# EAGLE design Ninja Breakout (EAGLE 5.11)
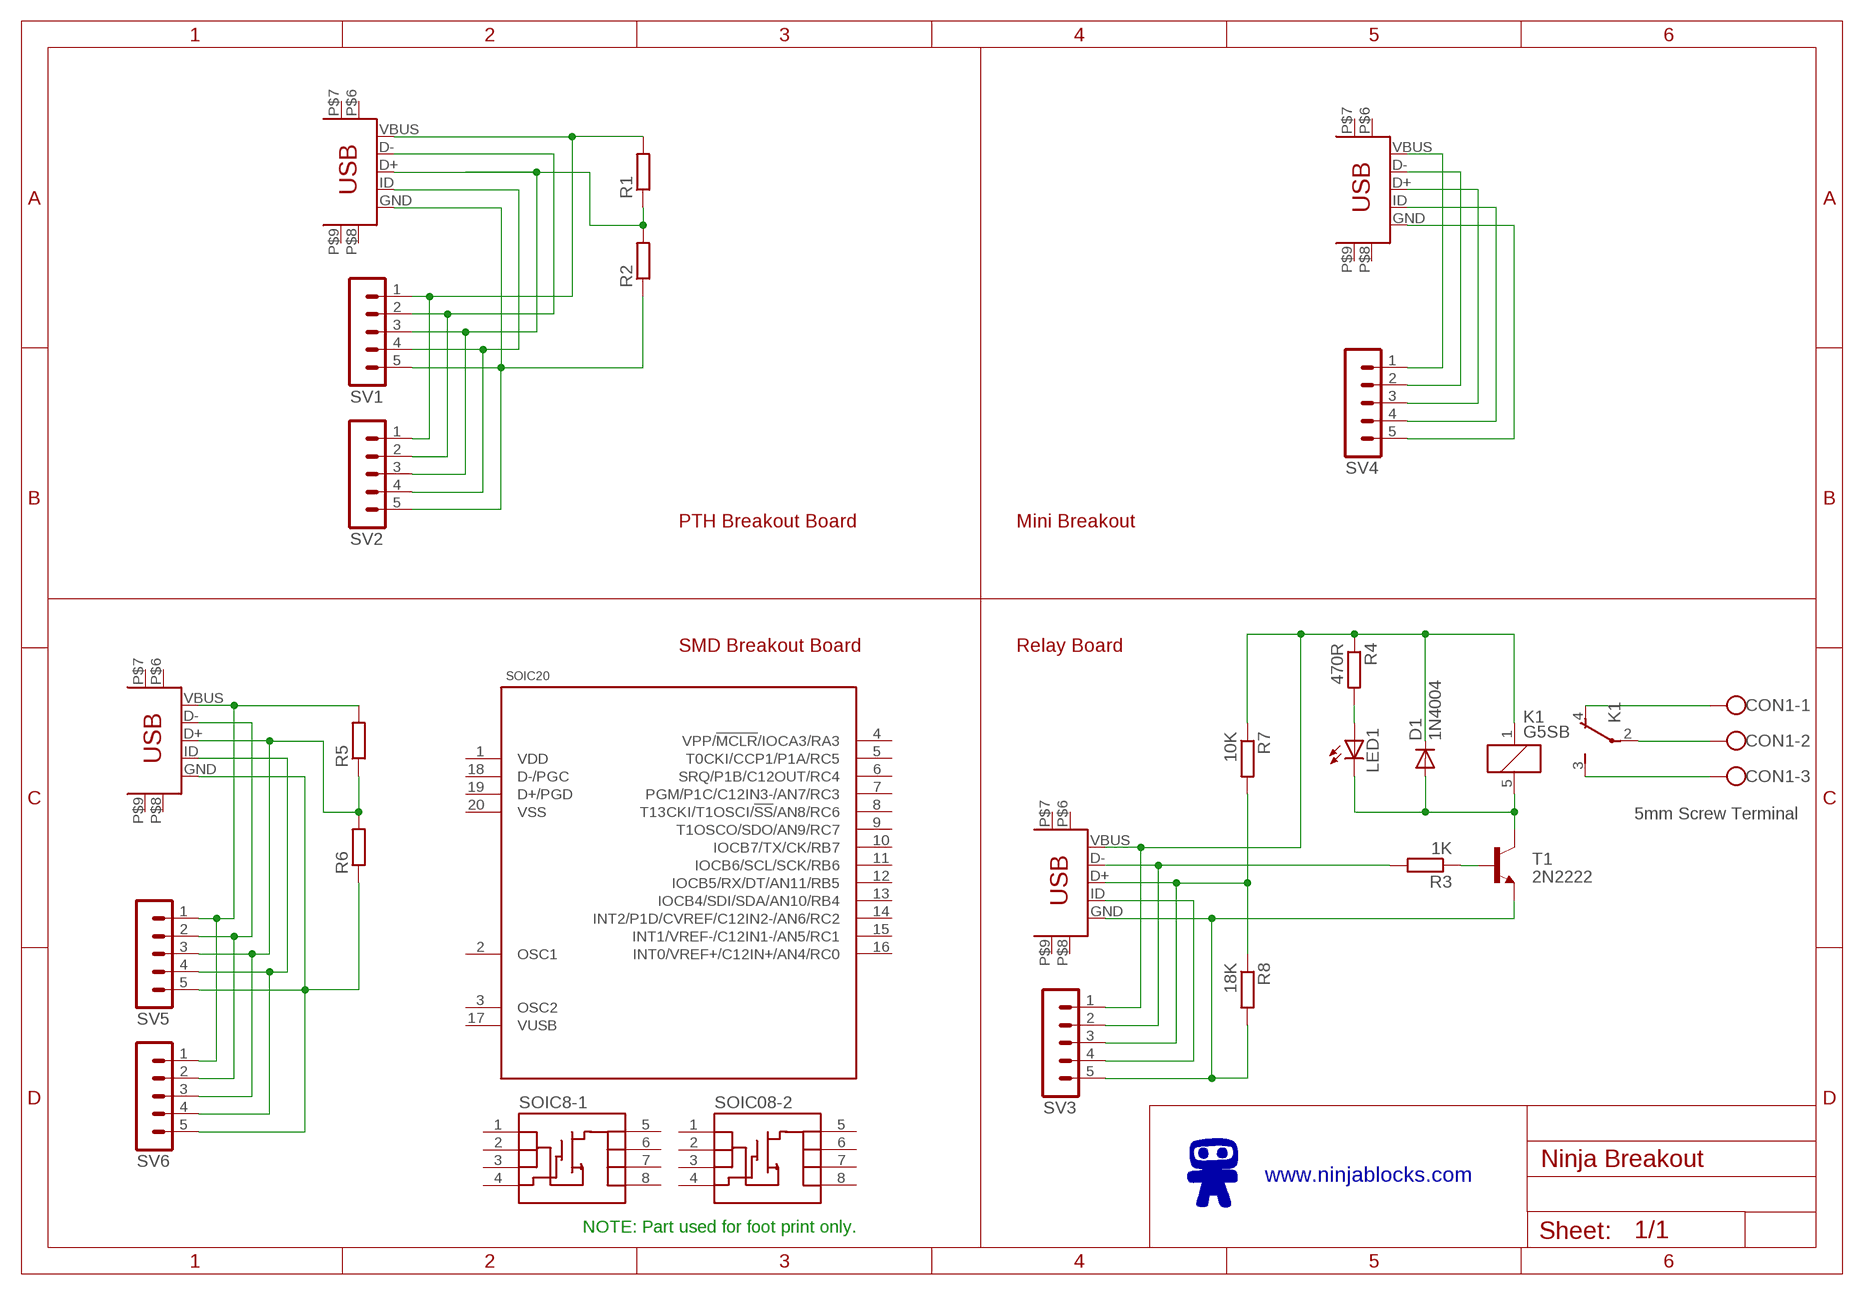
[diagram p0: schematic, sheet 1]

## Parts
CON1  5mm Screw Terminal  W237-103  [W237-103]
D1  1N4004  [DO41-10]
K1  G5SB  [G5SB]
LED1  LED3MM  [LED3MM]
R1  R-EU_0207/10  [0207/10]
R2  R-EU_0207/10  [0207/10]
R3  1K  R-EU_0207/10  [0207/10]
R4  470R  R-EU_0207/10  [0207/10]
R5  R-EU_0207/10  [0207/10]
R6  R-EU_0207/10  [0207/10]
R7  10K  R-EU_0207/10  [0207/10]
R8  18K  R-EU_0207/10  [0207/10]
SOIC8-1  MOSFET-NCHANNEL-SOIC8  [SO08]
SOIC08-2  MOSFET-NCHANNEL-SOIC8  [SO08]
SOIC20  PIC18F14K50-SOIC  [SO20W]
SV1  MA05-1  [MA05-1]
SV2  MA05-1  [MA05-1]
SV3  MA05-1  [MA05-1]
SV4  MA05-1  [MA05-1]
SV5  MA05-1  [MA05-1]
SV6  MA05-1  [MA05-1]
T1  2N2222  [TO92-EBC-OVAL]
U$1  MINI_B_PTH  [MINIB_PTH]
U$6  MINI_B_PTH  [MINIB_PTH]
U$7  MINI_B_PTH  [MINIB_PTH]
U$8  MINI_B_PTH  [MINIB_PTH]

## Nets
D+: R1.1 R2.2 SV1.3 SV2.3 U$1.D+
D-: SV1.2 SV2.2 U$1.D-
GND: R2.1 R6.1 R8.2 SV1.5 SV2.5 SV3.5 SV4.5 SV5.5 SV6.5 T1.E U$1.GND U$6.GND U$7.GND U$8.GND
ID: SV1.4 SV2.4 U$1.ID
N$254: D1.A K1.5 LED1.K(C) T1.C
N$271: CON1.1 K1.4(U:O)
N$278: D1.C K1.1 R4.1 R7.1 SV3.1 U$6.VBUS
N$279: R3.1 T1.B
N$280: R3.2 SV3.2 U$6.D-
N$281: LED1.A R4.2
N$282: CON1.2 K1.2(U:P)
N$283: CON1.3 K1.3(U:S)
N$284: R7.2 R8.1 SV3.3 U$6.D+
N$285: SV3.4 U$6.ID
N$287: SV4.1 U$7.VBUS
N$288: SV4.2 U$7.D-
N$289: SV4.3 U$7.D+
N$290: SV4.4 U$7.ID
N$292: R5.2 SV5.1 SV6.1 U$8.VBUS
N$293: SV5.2 SV6.2 U$8.D-
N$294: R5.1 R6.2 SV5.3 SV6.3 U$8.D+
N$295: SV5.4 SV6.4 U$8.ID
VBUS: R1.2 SV1.1 SV2.1 U$1.VBUS
Unconnected: SOIC8-1.1(S) SOIC8-1.2(S) SOIC8-1.3(S) SOIC8-1.4(G) SOIC8-1.5(D) SOIC8-1.6(D) SOIC8-1.7(D) SOIC8-1.8(D) SOIC08-2.1(S) SOIC08-2.2(S) SOIC08-2.3(S) SOIC08-2.4(G) SOIC08-2.5(D) SOIC08-2.6(D) SOIC08-2.7(D) SOIC08-2.8(D) SOIC20.2(OSC1) SOIC20.3(OSC2) SOIC20.4(VPP/!MCLR!/IOCA3/RA3) SOIC20.5(T0CKI/CCP1/P1A/RC5) SOIC20.6(SRQ/P1B/C12OUT/RC4) SOIC20.7(PGM/P1C/C12IN3-/AN7/RC3) SOIC20.8(T13CKI/T1OSCI/!SS!/AN8/RC6) SOIC20.9(T1OSCO/SDO/AN9/RC7) SOIC20.10(IOCB7/TX/CK/RB7) SOIC20.11(IOCB6/SCL/SCK/RB6) SOIC20.12(IOCB5/RX/DT/AN11/RB5) SOIC20.13(IOCB4/SDI/SDA/AN10/RB4) SOIC20.14(INT2/P1D/CVREF/C12IN2-/AN6/RC2) SOIC20.15(INT1/VREF-/C12IN1-/AN5/RC1) SOIC20.16(INT0/VREF+/C12IN+/AN4/RC0) SOIC20.18(D-/PGC) SOIC20.19(D+/PGD) U$1.P$6(MTN1) U$1.P$7(MTN2) U$1.P$8(MTN3) U$1.P$9(MTN4) U$6.P$6(MTN1) U$6.P$7(MTN2) U$6.P$8(MTN3) U$6.P$9(MTN4) U$7.P$6(MTN1) U$7.P$7(MTN2) U$7.P$8(MTN3) U$7.P$9(MTN4) U$8.P$6(MTN1) U$8.P$7(MTN2) U$8.P$8(MTN3) U$8.P$9(MTN4)

## Notes on the sheet
- PTH Breakout Board | Mini Breakout
- SMD Breakout Board | Relay Board
- www.ninjablocks.com
- NOTE: Part used for foot print only.

## Power pins joined to a net without a drawn wire
VDD: SOIC20.1(VDD)
VSS: SOIC20.20(VSS)
VUSB: SOIC20.17(VUSB)

## Library data of the parts
CON1 = con-wago-500:W237-103: WAGO SCREW CLAMP; MPN: 237-103; OC_FARNELL: unknown; OC_NEWARK: 18M7116
D1 = adafruit:1N4004: DIODE General purpose 1N400x type rectifier (With bigger pads) http://www.ladyada.net/library/pcb/eaglelibrary.html
K1 = relay:G5SB: Compact Single-pole Relay for Switching 5 A Source: http://www.omron.com/ecb/products/pry/121/g5sb.html; OC_FARNELL: unknown; OC_NEWARK: unknown
LED1 = adafruit:LED: LED OSRAM: - CHIPLED LG R971, LG N971, LY N971, LG Q971, LY Q971, LO R971, LY R971 LH N974, LH R974 LS Q976, LO Q976, LY Q976 LO Q996 - Hyper CHIPLED LW Q18S LB Q993, LB Q99A, LB R99A - SideLED LS A670, LO A670, LY A670, LG A670, LP A670 LB A673, LV A673, LT A673, LW A673 LH A674 LY A675 LS A676, LA A676, LO A676, LY A676, LW A676 LS A679, LY A679, LG A679 - Hyper Micro SIDELED® LS Y876, LA Y876, LO Y876, LY Y876 LT Y87S - SmartLED LW L88C, LW L88S LB L89C, LB L89S, LG L890 LS L89K, LO L89K, LY L89K LS L896, LA L896, LO L896, LY L896 - TOPLED LS T670, LO T670, LY T670, LG T670, LP T670 LSG T670, LSP T670, LSY T670, LOP T670, LYG T670 LG T671, LOG T671, LSG T671 LB T673, LV T673, LT T673, LW T673 LH T674 LS T676, LA T676, LO T676, LY T676, LB T676, LH T676, LSB T676, LW T676 LB T67C, LV T67C, LT T67C, LS T67K, LO T67K, LY T67K, LW E67C LS E67B, LA E67B, LO E67B, LY E67B, LB E67C, LV E67C, LT E67C LW T67C LS T679, LY T679, LG T679 LS T770, LO T770, LY T770, LG T770, LP T770 LB T773, LV T773, LT T773, LW T773 LH T774 LS E675, LA E675, LY E675, LS T675 LS T776, LA T776, LO T776, LY T776, LB T776 LHGB T686 LT T68C, LB T68C - Hyper Mini TOPLED® LB M676 - Mini TOPLED Santana® LG M470 LS M47K, LO M47K, LY M47K Source: http://www.osram.convergy.de/
R1-R8 = resistor:R-EU_: RESISTOR, European symbol
SOIC8-1 SOIC08-2 = SparkFun:MOSFET-NCHANNEL-SOIC8: N-Channel MOSFET IRF9410 and NDS8434 are common, SOIC-8 parts.
SOIC20 = Monkey:PIC18F14K50: PIC18F/LF1XK50 20-Pin USB Flash Microcontrollers with nanoWatt XLP Technology. PIC18F13K50, PIC18LF13K50, PIC18F14K50, PIC18LF14K50. From: http://ww1.microchip.com/downloads/en/DeviceDoc/41350E.pdf
SV1-SV6 = con-lstb:MA05-1: PIN HEADER; OC_FARNELL: unknown; OC_NEWARK: unknown
T1 = adafruit:2N2222: NPN TRANSISTOR Big oval pads
U$1 U$6-U$8 = Ninja:MINI_B_PTH: WUERTH ELEKTRONIK - 651005136521 - MINI USB TYPE B, RECEPTACLE http://au.element14.com/wuerth-elektronik/651005136521/mini-usb-type-b-receptacle-r-a/dp/1841176

## Board
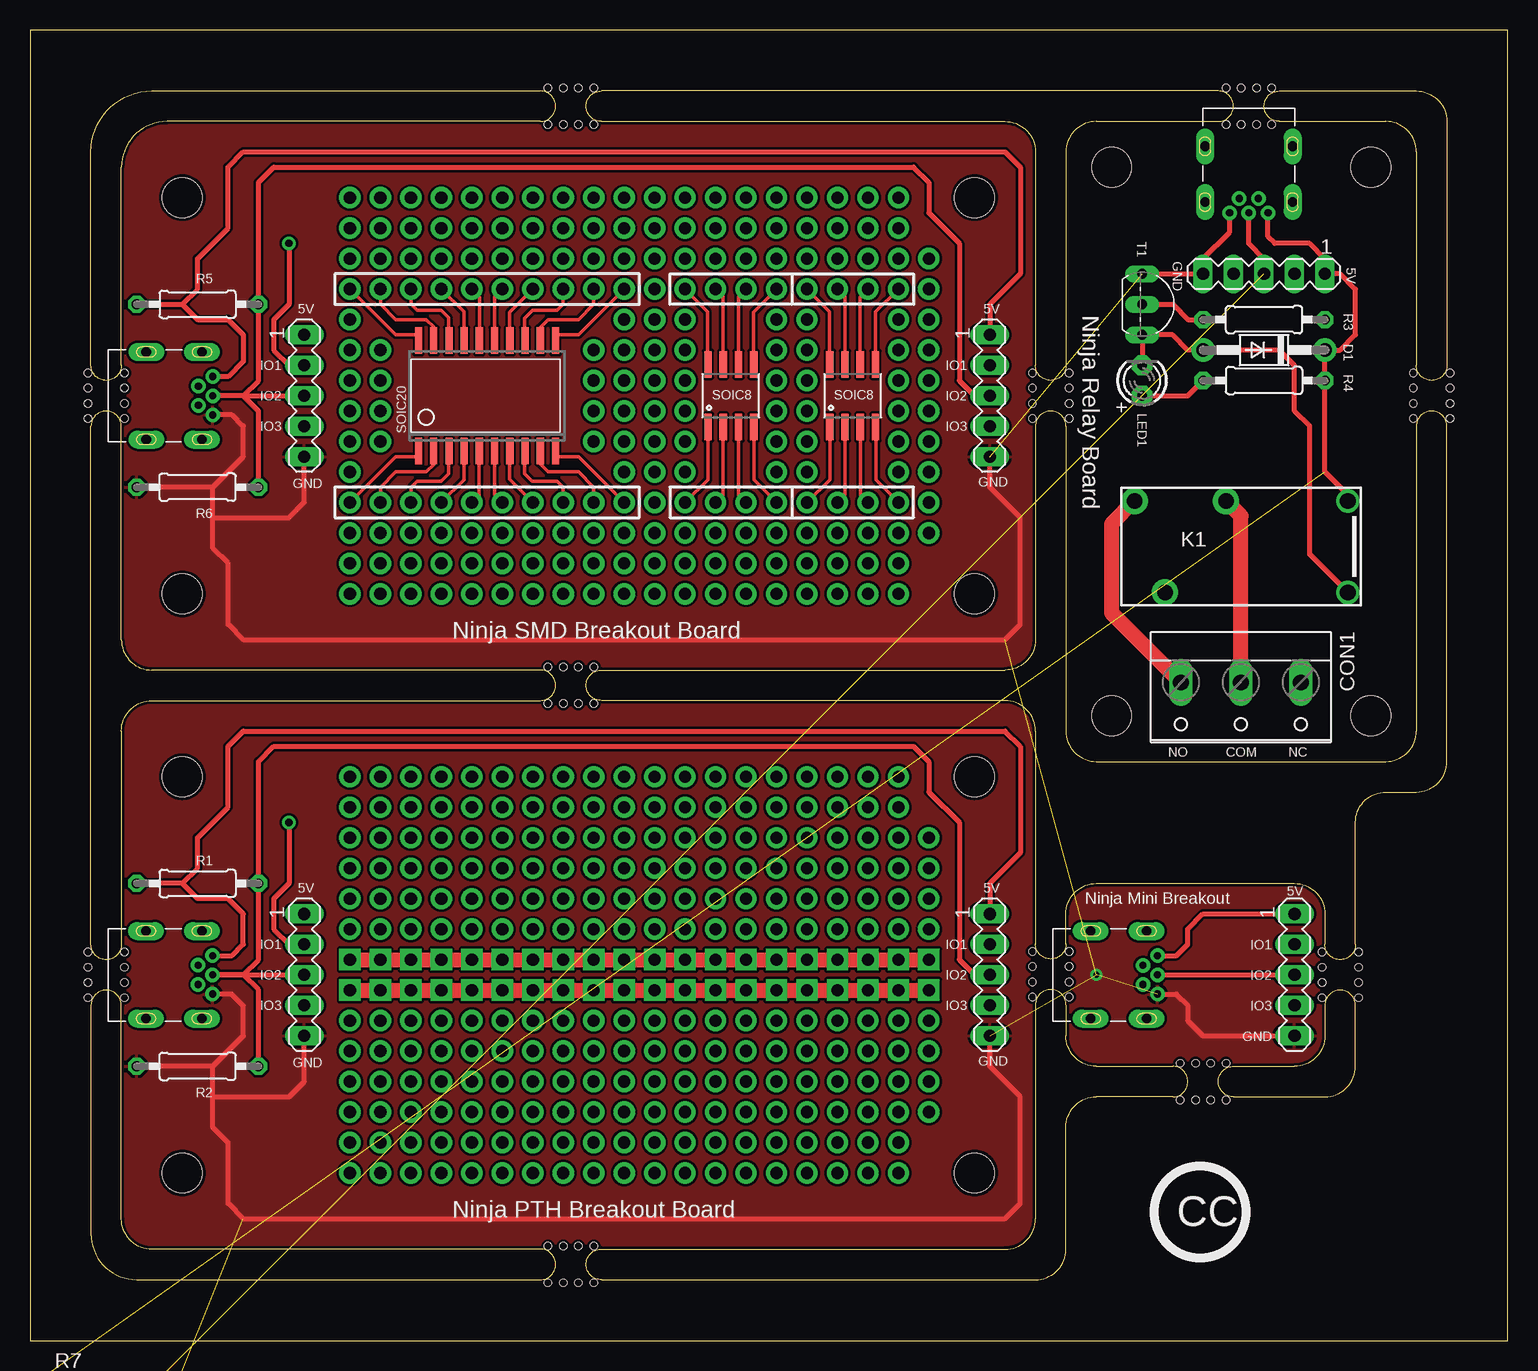
[diagram p1: board, top side]
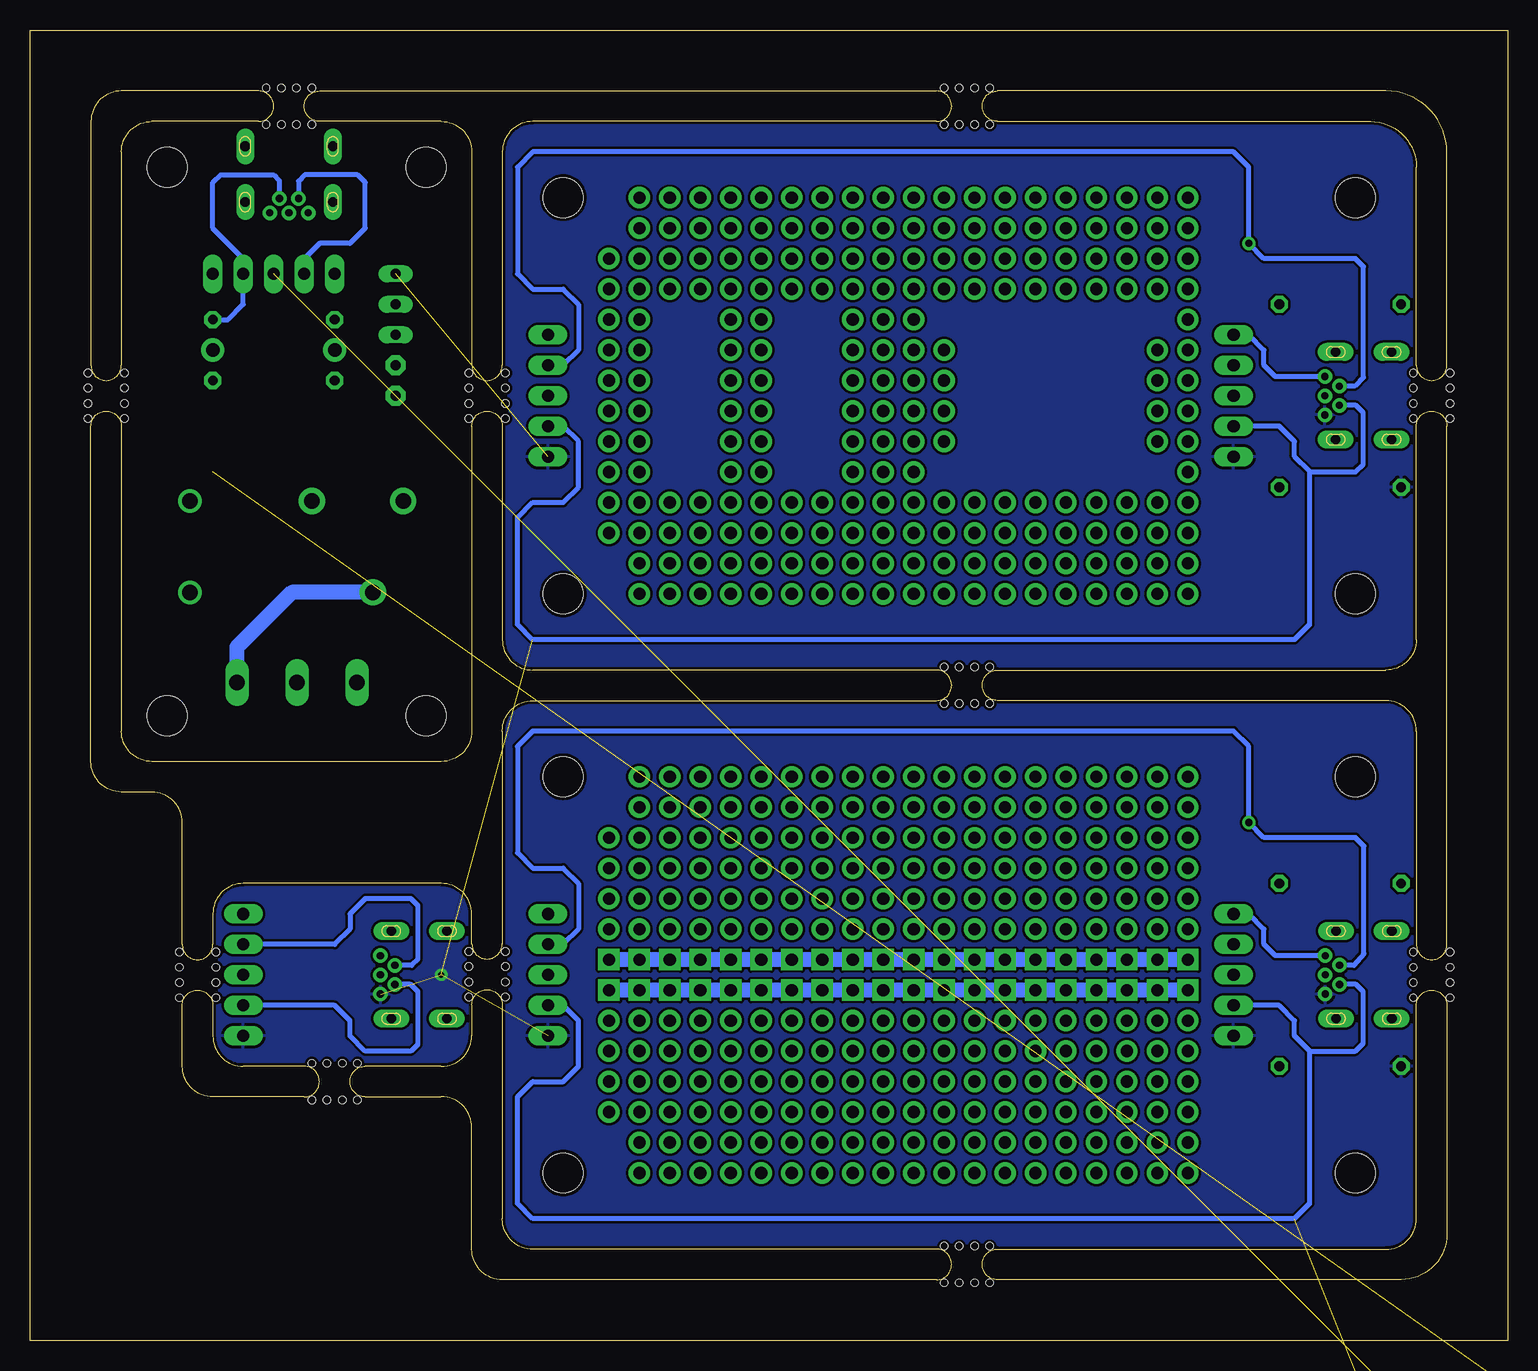
[diagram p2: board, bottom side, seen from below]

Size 123.19 x 109.22 mm. Coordinates in mm from the lower left corner, seen from the top.
Outline: 86.36,27.99 arc90 85.09,29.26 arc90 83.82,27.99
Outline: 86.36,33.07 arc-90 85.09,31.8 arc-90 83.82,33.07
Outline: 83.82,33.02 83.82,50.8 arc90 81.28,53.34 47.62,53.34 arc-90 46.35,54.61 arc-90 47.62,55.88 81.28,55.88 arc90 83.82,58.42 83.82,76.2 arc-90 85.09,77.47 arc-90 86.36,76.2 86.36,50.8 arc90 88.9,48.26 113.03,48.26 arc90 115.57,50.8 115.57,76.2 arc-90 116.84,77.47 arc-90 118.11,76.2 118.11,48.26 arc-90 115.57,45.72 113.03,45.72 arc90 110.49,43.18 110.49,33.02 arc-90 109.22,31.75 arc-90 107.95,33.02 107.95,35.56 arc90 105.41,38.1 88.9,38.1 arc90 86.36,35.56 86.36,33.02
Outline: 83.82,27.94 83.82,10.16 arc-90 81.28,7.62 47.62,7.62 arc90 46.35,6.35 arc90 47.62,5.08 83.82,5.08 arc90 86.36,7.62 86.36,17.78 arc-90 88.9,20.32 95.25,20.32 arc90 96.52,21.59 arc90 95.25,22.86 88.9,22.86 arc-90 86.36,25.4 86.36,27.94
Outline: 88.9,101.6 arc90 86.36,99.06 86.36,81.28 arc-90 85.09,80.01 arc-90 83.82,81.28 83.82,99.06 arc90 81.28,101.6 47.62,101.6 arc-90 46.35,102.87 arc-90 47.62,104.14 99.06,104.14 arc-90 100.33,102.87 arc-90 99.06,101.6 88.9,101.6
Outline: 115.57,99.06 arc90 113.03,101.6 104.14,101.6 arc-90 102.87,102.87 arc-90 104.14,104.14 115.57,104.14 arc-90 118.11,101.6 118.11,81.28 arc-90 116.84,80.01 arc-90 115.57,81.28 115.57,99.06
Outline: 107.95,25.4 arc-90 105.41,22.86 100.33,22.86 arc90 99.06,21.59 arc90 100.33,20.32 107.95,20.32 arc90 110.49,22.86 110.49,27.94 arc90 109.22,29.21 arc90 107.95,27.94 107.95,25.4
Outline: 42.54,53.34 arc90 43.81,54.61 arc90 42.54,55.88 10.16,55.88 arc-90 7.62,58.42 7.62,76.2 arc90 6.35,77.47 arc90 5.08,76.2 5.08,33.02 arc90 6.35,31.75 arc90 7.62,33.02 7.62,50.8 arc-90 10.16,53.34 42.54,53.34
Outline: 7.62,81.28 arc-90 6.35,80.01 arc-90 5.08,81.28 5.08,99.06 arc-90 10.16,104.14 42.54,104.14 arc-90 43.81,102.87 arc-90 42.54,101.6 11.43,101.6 arc90 7.62,97.79 7.62,81.28
Outline: 7.62,27.94 arc90 6.35,29.21 arc90 5.08,27.94 5.08,8.89 arc90 8.89,5.08 42.54,5.08 arc90 43.81,6.35 arc90 42.54,7.62 10.16,7.62 arc-90 7.62,10.16 7.62,27.94
Outline: 123.19,0 123.19,109.22 0,109.22 0,0 123.19,0
Copper layers (1*16): Top 0.035mm / dielectric 1.5mm / Bottom 0.035mm
Design rules "SparkFun": minimum track width 8mil, minimum drill 20mil, track to track 8mil, track to pad 8mil, pad to pad 8mil, via to via 8mil, smd to smd 8mil, copper to edge 10mil, drill to drill 8mil, minimum pad ring 12mil, minimum via ring 10mil, stop-mask expansion 4mil, vias tented up to drill 25mil, thermal gap 10mil
Holes 0.6 mm at 45.72,53.09 44.45,53.09 43.18,53.09 46.99,53.09 45.72,56.13 44.45,56.13 43.18,56.13 46.99,56.13 86.61,31.17 86.61,29.9 86.61,28.63 86.61,32.44 83.57,31.17 83.57,29.9 83.57,28.63 83.57,32.44 7.87,79.38 7.87,78.1 7.87,76.83 7.87,80.64 4.83,79.38 4.83,78.1 4.83,76.83 4.83,80.64 7.87,31.12 7.87,29.84 7.87,28.57 7.87,32.38 4.83,31.12 4.83,29.84 4.83,28.57 4.83,32.38 45.72,4.83 44.45,4.83 43.18,4.83 46.99,4.83 45.72,7.87 44.45,7.87 43.18,7.87 46.99,7.87 45.72,101.35 44.45,101.35 43.18,101.35 46.99,101.35 45.72,104.39 44.45,104.39 43.18,104.39 46.99,104.39 86.61,79.38 86.61,78.1 86.61,76.83 86.61,80.64 83.57,79.38 83.57,78.1 83.57,76.83 83.57,80.64 118.36,79.38 118.36,78.1 118.36,76.83 118.36,80.64 115.32,79.38 115.32,78.1 115.32,76.83 115.32,80.64 110.74,31.12 110.74,29.84 110.74,28.57 110.74,32.38 107.7,31.12 107.7,29.84 107.7,28.57 107.7,32.38 102.23,101.35 100.97,101.35 99.7,101.35 103.51,101.35 102.23,104.39 100.97,104.39 99.7,104.39 103.51,104.39 98.43,20.07 97.16,20.07 95.89,20.07 99.7,20.07 98.43,23.11 97.16,23.11 95.89,23.11 99.7,23.11

### Footprints (pad centres in the part's own frame; a part is rotated, then mirrored left to right if it is on the bottom)
W237-103 = drill 1.3 long: 1 -5,-1.29; 2 0,-1.29; 3 5,-1.29
DO41-10 = drill 1.118 pad 1.93 round: A 5.08,0; C -5.08,0
G5SB = drill 1.3 pad 1.93 round: 1 7.62,3.81; 5 7.62,-3.81 | drill 1.3 pad 2.184 round: 2 -2.54,3.81; 3 -10.16,3.81; 4 -7.62,-3.81
LED3MM = drill 0.813 pad 1.676 octagon: A -1.27,0; K 1.27,0
0207/10 = drill 0.813 octagon: 1 -5.08,0; 2 5.08,0
SO08 = smd 0.61 x 2.21: 1 -1.905,-2.616; 2 -0.635,-2.616; 3 0.635,-2.616; 4 1.905,-2.616; 5 1.905,2.616; 6 0.635,2.616; 7 -0.635,2.616; 8 -1.905,2.616
SO20W = smd 0.6 x 2.2: 1 -5.715,-4.6; 2 -4.445,-4.6; 3 -3.175,-4.6; 4 -1.905,-4.6; 5 -0.635,-4.6; 6 0.635,-4.6; 7 1.905,-4.6; 8 3.175,-4.6; 9 4.445,-4.6; 10 5.715,-4.6; 11 5.715,4.6; 12 4.445,4.6; 13 3.175,4.6; 14 1.905,4.6; 15 0.635,4.6; 16 -0.635,4.6; 17 -1.905,4.6; 18 -3.175,4.6; 19 -4.445,4.6; 20 -5.715,4.6
MA05-1 = drill 1.016 long: 1 -5.08,0; 2 -2.54,0; 3 0,0; 4 2.54,0; 5 5.08,0
TO92-EBC-OVAL = drill 0.813 long: B 0,-1.27; C 2.54,-1.27; E -2.54,-1.27
MINIB_PTH = drill 0.6 round: D+ 0,0; D- 0.8,1.2; GND -1.6,0; ID -0.8,1.2; VBUS 1.6,0 | drill 0.8 pad 1.5 long: P$6 3.65,0.9; P$7 3.65,5.55; P$8 -3.65,0.9; P$9 -3.65,5.55
STAND-OFF = hole 3.302: 0,0

### Placement (x,y rotation side)
CON1  100.94,53.57 180 top
D1  102.87,82.55 180 top
K1  102.23,66.17 0 top
LED1  92.71,80.01 90 top
R1  13.97,38.1 180 top
R2  13.97,22.86 0 top
R3  102.87,85.09 0 top
R4  102.87,80.01 180 top
R5  13.97,86.36 180 top
R6  13.97,71.12 0 top
R7  5.08,-3.81 0 top  (outside the outline)
R8  5.08,-8.89 0 top  (outside the outline)
SOIC8-1  58.42,78.74 0 top
SOIC08-2  68.58,78.74 0 top
SOIC20  38.1,78.74 0 top
SV1  80.01,30.48 270 top
SV2  22.86,30.48 270 top
SV3  102.87,88.9 180 top
SV4  105.41,30.48 270 top
SV5  22.86,78.74 270 top
SV6  80.01,78.74 270 top
T1  93.98,86.36 270 top
U$1  15.22,30.49 90 top
U$2  [STAND-OFF]  12.7,46.99 0 top
U$3  [STAND-OFF]  12.7,13.97 0 top
U$4  [STAND-OFF]  78.74,13.97 0 top
U$5  [STAND-OFF]  78.74,46.99 0 top
U$6  101.6,93.98 0 top
U$7  93.98,30.48 90 top
U$8  15.24,78.74 90 top
U$9  [STAND-OFF]  12.7,95.25 0 top
U$10  [STAND-OFF]  12.7,62.23 0 top
U$11  [STAND-OFF]  78.74,95.25 0 top
U$12  [STAND-OFF]  78.74,62.23 0 top
U$13  [STAND-OFF]  111.76,52.07 270 top
U$14  [STAND-OFF]  90.17,52.07 270 top
U$15  [STAND-OFF]  90.17,97.79 270 top
U$16  [STAND-OFF]  111.76,97.79 270 top

### Tracks (layer width: path | path; a pad name or v marks a point on that pad's centre or on a via)
D+
  Top 0.406: SV1.3 78.74,30.48 77.47,31.75 77.47,43.18 74.93,45.72 74.93,48.26 73.66,49.53 20.32,49.53 19.05,48.26 R1.1 19.05,31.75 17.79,30.48 | 17.79,30.48 U$1.D+ SV2.3 | R2.2 19.05,29.22 17.79,30.48
D-  (via drill 0.6)
  Top 0.406: SV2.2 21.59,33.02 20.32,34.29 20.32,36.83 21.59,38.1 v21.59,43.18
  Bottom 0.406: U$1.D- 12.82,31.28 11.99,32.26 11.99,41.2 12.7,41.91 20.32,41.91 v21.59,43.18 21.59,49.53 22.86,50.8 81.28,50.8 82.55,49.53 82.55,40.64 81.28,39.37 78.74,39.37 77.47,38.1 77.47,34.29 78.74,33.02 SV1.2
GND  (via drill 0.5)  (5 unrouted)
  Top 0.406: 15.24,22.86 R2.1 | 15.24,22.86 17.78,25.4 17.78,27.91 16.82,28.88 U$1.GND | SV2.5 22.86,21.59 21.59,20.32 15.24,20.32 | 15.24,20.32 15.24,17.78 16.51,16.51 16.51,11.43 17.78,10.16 81.28,10.16 82.55,11.43 82.55,20.32 80.01,22.86 SV1.5 | 15.24,20.32 15.24,22.86 | T1.E SV3.5 97.79,90.17 100,92.38 U$6.GND | U$7.GND 95.58,28.88 96.52,27.94 96.52,26.67 97.79,25.4 SV4.5 | U$8.GND 16.84,77.14 17.78,76.2 17.78,73.66 15.24,71.12 | 15.24,71.12 R6.1 | SV5.5 22.86,69.85 21.59,68.58 15.24,68.58 | 15.24,68.58 15.24,71.12 | 15.24,68.58 15.24,66.04 16.51,64.77 16.51,59.69 17.78,58.42 81.28,58.42 82.55,59.69 82.55,68.58 80.01,71.12 SV6.5
  other vias: 88.9,30.48
  pour Top: -1.27,110.49 85.09,110.49 85.09,109.22 85.09,46.99 124.46,46.99 124.46,-1.27 -1.27,-1.27 -1.27,0
  pour Bottom: -1.27,110.49 85.09,110.49 85.09,73.66 85.09,46.99 124.46,46.99 124.46,-1.27 -1.27,-1.27
ID
  Bottom 0.406: U$1.ID 12.67,29.69 12.07,29.08 12.07,24.77 12.7,24.13 16.51,24.13 | 16.51,24.13 17.78,25.4 17.78,26.67 19.05,27.94 SV2.4 | 16.51,24.13 16.51,11.43 17.78,10.16 81.28,10.16 82.55,11.43 82.55,20.32 81.28,21.59 78.74,21.59 77.47,22.86 77.47,26.67 78.74,27.94 SV1.4
N$1  (via drill 1.02 pad 1.78)
  other vias: 26.67,46.99
N$2  (via drill 1.02 pad 1.78)
  other vias: 29.21,46.99
N$3  (via drill 1.02 pad 1.78)
  other vias: 31.75,46.99
N$4  (via drill 1.02 pad 1.78)
  other vias: 26.67,26.67
N$5  (via drill 1.02 pad 1.78)
  Top 1.27: v26.67,31.75 v74.93,31.75
  Bottom 1.27: v26.67,31.75 v74.93,31.75
N$6  (via drill 1.02 pad 1.78)
  other vias: 29.21,26.67
N$7  (via drill 1.02 pad 1.78)
  other vias: 31.75,26.67
N$8  (via drill 1.02 pad 1.78)
  other vias: 34.29,26.67
N$9  (via drill 1.02 pad 1.78)
  other vias: 36.83,26.67
N$10  (via drill 1.02 pad 1.78)
  other vias: 34.29,46.99
N$11  (via drill 1.02 pad 1.78)
  other vias: 39.37,26.67
N$12  (via drill 1.02 pad 1.78)
  other vias: 36.83,46.99
N$13  (via drill 1.02 pad 1.78)
  other vias: 39.37,46.99
N$14  (via drill 1.02 pad 1.78)
  other vias: 41.91,46.99
N$15  (via drill 1.02 pad 1.78)
  other vias: 54.61,46.99
N$16  (via drill 1.02 pad 1.78)
  other vias: 57.15,46.99
N$17  (via drill 1.02 pad 1.78)
  other vias: 69.85,46.99
N$18  (via drill 1.02 pad 1.78)
  other vias: 29.21,31.75
N$19  (via drill 1.02 pad 1.78)
  other vias: 29.21,29.21
N$20  (via drill 1.02 pad 1.78)
  other vias: 41.91,26.67
N$21  (via drill 1.02 pad 1.78)
  other vias: 54.61,26.67
N$22  (via drill 1.02 pad 1.78)
  other vias: 26.67,24.13
N$23  (via drill 1.02 pad 1.78)
  other vias: 29.21,24.13
N$24  (via drill 1.02 pad 1.78)
  other vias: 31.75,24.13
N$25  (via drill 1.02 pad 1.78)
  other vias: 26.67,44.45
N$26  (via drill 1.02 pad 1.78)
  other vias: 29.21,44.45
N$27  (via drill 1.02 pad 1.78)
  other vias: 31.75,44.45
N$28  (via drill 1.02 pad 1.78)
  other vias: 31.75,31.75
N$29  (via drill 1.02 pad 1.78)
  other vias: 31.75,29.21
N$30  (via drill 1.02 pad 1.78)
  other vias: 34.29,24.13
N$31  (via drill 1.02 pad 1.78)
  other vias: 36.83,24.13
N$32  (via drill 1.02 pad 1.78)
  other vias: 39.37,24.13
N$33  (via drill 1.02 pad 1.78)
  other vias: 41.91,24.13
N$34  (via drill 1.02 pad 1.78)
  other vias: 34.29,44.45
N$35  (via drill 1.02 pad 1.78)
  other vias: 44.45,24.13
N$36  (via drill 1.02 pad 1.78)
  other vias: 36.83,44.45
N$37  (via drill 1.02 pad 1.78)
  other vias: 39.37,44.45
N$38  (via drill 1.02 pad 1.78)
  other vias: 41.91,44.45
N$39  (via drill 1.02 pad 1.78)
  other vias: 44.45,44.45
N$40  (via drill 1.02 pad 1.78)
  other vias: 54.61,44.45
N$41  (via drill 1.02 pad 1.78)
  other vias: 59.69,44.45
N$42  (via drill 1.02 pad 1.78)
  other vias: 34.29,31.75
N$43  (via drill 1.02 pad 1.78)
  other vias: 34.29,29.21
N$44  (via drill 1.02 pad 1.78)
  other vias: 26.67,21.59
N$45  (via drill 1.02 pad 1.78)
  other vias: 29.21,21.59
N$46  (via drill 1.02 pad 1.78)
  other vias: 31.75,21.59
N$47  (via drill 1.02 pad 1.78)
  other vias: 34.29,21.59
N$48  (via drill 1.02 pad 1.78)
  other vias: 36.83,21.59
N$49  (via drill 1.02 pad 1.78)
  other vias: 26.67,41.91
N$50  (via drill 1.02 pad 1.78)
  other vias: 29.21,41.91
N$51  (via drill 1.02 pad 1.78)
  other vias: 31.75,41.91
N$52  (via drill 1.02 pad 1.78)
  other vias: 36.83,31.75
N$53  (via drill 1.02 pad 1.78)
  other vias: 36.83,29.21
N$54  (via drill 1.02 pad 1.78)
  other vias: 39.37,21.59
N$55  (via drill 1.02 pad 1.78)
  other vias: 41.91,21.59
N$56  (via drill 1.02 pad 1.78)
  other vias: 44.45,21.59
N$57  (via drill 1.02 pad 1.78)
  other vias: 26.67,19.05
N$58  (via drill 1.02 pad 1.78)
  other vias: 34.29,41.91
N$59  (via drill 1.02 pad 1.78)
  other vias: 29.21,19.05
N$60  (via drill 1.02 pad 1.78)
  other vias: 36.83,41.91
N$61  (via drill 1.02 pad 1.78)
  other vias: 39.37,41.91
N$62  (via drill 1.02 pad 1.78)
  other vias: 41.91,41.91
N$63  (via drill 1.02 pad 1.78)
  other vias: 44.45,41.91
N$64  (via drill 1.02 pad 1.78)
  other vias: 49.53,41.91
N$65  (via drill 1.02 pad 1.78)
  other vias: 69.85,41.91
N$66  (via drill 1.02 pad 1.78)
  other vias: 39.37,31.75
N$67  (via drill 1.02 pad 1.78)
  other vias: 39.37,29.21
N$68  (via drill 1.02 pad 1.78)
  other vias: 31.75,19.05
N$69  (via drill 1.02 pad 1.78)
  other vias: 34.29,19.05
N$70  (via drill 1.02 pad 1.78)
  other vias: 36.83,19.05
N$71  (via drill 1.02 pad 1.78)
  other vias: 39.37,19.05
N$72  (via drill 1.02 pad 1.78)
  other vias: 41.91,19.05
N$73  (via drill 1.02 pad 1.78)
  other vias: 26.67,39.37
N$74  (via drill 1.02 pad 1.78)
  other vias: 29.21,39.37
N$75  (via drill 1.02 pad 1.78)
  other vias: 31.75,39.37
N$76  (via drill 1.02 pad 1.78)
  other vias: 41.91,31.75
N$77  (via drill 1.02 pad 1.78)
  other vias: 41.91,29.21
N$78  (via drill 1.02 pad 1.78)
  other vias: 44.45,19.05
N$79  (via drill 1.02 pad 1.78)
  other vias: 26.67,16.51
N$80  (via drill 1.02 pad 1.78)
  other vias: 29.21,16.51
N$81  (via drill 1.02 pad 1.78)
  other vias: 31.75,16.51
N$82  (via drill 1.02 pad 1.78)
  other vias: 34.29,39.37
N$83  (via drill 1.02 pad 1.78)
  other vias: 34.29,16.51
N$84  (via drill 1.02 pad 1.78)
  other vias: 36.83,39.37
N$85  (via drill 1.02 pad 1.78)
  other vias: 39.37,39.37
N$86  (via drill 1.02 pad 1.78)
  other vias: 41.91,39.37
N$87  (via drill 1.02 pad 1.78)
  other vias: 44.45,39.37
N$88  (via drill 1.02 pad 1.78)
  other vias: 49.53,39.37
N$89  (via drill 1.02 pad 1.78)
  other vias: 59.69,39.37
N$90  (via drill 1.02 pad 1.78)
  other vias: 44.45,31.75
N$91  (via drill 1.02 pad 1.78)
  other vias: 44.45,29.21
N$92  (via drill 1.02 pad 1.78)
  other vias: 36.83,16.51
N$93  (via drill 1.02 pad 1.78)
  other vias: 39.37,16.51
N$94  (via drill 1.02 pad 1.78)
  other vias: 41.91,16.51
N$95  (via drill 1.02 pad 1.78)
  other vias: 44.45,16.51
N$96  (via drill 1.02 pad 1.78)
  other vias: 26.67,13.97
N$97  (via drill 1.02 pad 1.78)
  other vias: 26.67,36.83
N$98  (via drill 1.02 pad 1.78)
  other vias: 29.21,36.83
N$99  (via drill 1.02 pad 1.78)
  other vias: 31.75,36.83
N$100  (via drill 1.02 pad 1.78)
  other vias: 46.99,31.75
N$101  (via drill 1.02 pad 1.78)
  other vias: 46.99,29.21
N$102  (via drill 1.02 pad 1.78)
  other vias: 29.21,13.97
N$103  (via drill 1.02 pad 1.78)
  other vias: 31.75,13.97
N$104  (via drill 1.02 pad 1.78)
  other vias: 34.29,13.97
N$105  (via drill 1.02 pad 1.78)
  other vias: 36.83,13.97
N$106  (via drill 1.02 pad 1.78)
  other vias: 34.29,36.83
N$107  (via drill 1.02 pad 1.78)
  other vias: 39.37,13.97
N$108  (via drill 1.02 pad 1.78)
  other vias: 36.83,36.83
N$109  (via drill 1.02 pad 1.78)
  other vias: 39.37,36.83
N$110  (via drill 1.02 pad 1.78)
  other vias: 41.91,36.83
N$111  (via drill 1.02 pad 1.78)
  other vias: 44.45,36.83
N$112  (via drill 1.02 pad 1.78)
  other vias: 52.07,36.83
N$113  (via drill 1.02 pad 1.78)
  other vias: 69.85,36.83
N$114  (via drill 1.02 pad 1.78)
  other vias: 49.53,31.75
N$115  (via drill 1.02 pad 1.78)
  other vias: 49.53,29.21
N$116  (via drill 1.02 pad 1.78)
  other vias: 41.91,13.97
N$117  (via drill 1.02 pad 1.78)
  other vias: 44.45,13.97
N$118  (via drill 1.02 pad 1.78)
  other vias: 57.15,26.67
N$119  (via drill 1.02 pad 1.78)
  other vias: 46.99,24.13
N$120  (via drill 1.02 pad 1.78)
  other vias: 49.53,24.13
N$121  (via drill 1.02 pad 1.78)
  other vias: 26.67,34.29
N$122  (via drill 1.02 pad 1.78)
  other vias: 29.21,34.29
N$123  (via drill 1.02 pad 1.78)
  other vias: 31.75,34.29
N$124  (via drill 1.02 pad 1.78)
  other vias: 52.07,31.75
N$125  (via drill 1.02 pad 1.78)
  other vias: 52.07,29.21
N$126  (via drill 1.02 pad 1.78)
  other vias: 54.61,24.13
N$127  (via drill 1.02 pad 1.78)
  other vias: 52.07,24.13
N$128  (via drill 1.02 pad 1.78)
  other vias: 59.69,26.67
N$129  (via drill 1.02 pad 1.78)
  other vias: 62.23,26.67
N$130  (via drill 1.02 pad 1.78)
  other vias: 34.29,34.29
N$131  (via drill 1.02 pad 1.78)
  other vias: 64.77,26.67
N$132  (via drill 1.02 pad 1.78)
  other vias: 36.83,34.29
N$133  (via drill 1.02 pad 1.78)
  other vias: 39.37,34.29
N$134  (via drill 1.02 pad 1.78)
  other vias: 41.91,34.29
N$135  (via drill 1.02 pad 1.78)
  other vias: 44.45,34.29
N$136  (via drill 1.02 pad 1.78)
  other vias: 54.61,34.29
N$137  (via drill 1.02 pad 1.78)
  other vias: 59.69,34.29
N$138  (via drill 1.02 pad 1.78)
  other vias: 54.61,31.75
N$139  (via drill 1.02 pad 1.78)
  other vias: 54.61,29.21
N$140  (via drill 1.02 pad 1.78)
  other vias: 69.85,26.67
N$141  (via drill 1.02 pad 1.78)
  other vias: 67.31,26.67
N$142  (via drill 1.02 pad 1.78)
  other vias: 69.85,24.13
N$143  (via drill 1.02 pad 1.78)
  other vias: 67.31,24.13
N$144  (via drill 1.02 pad 1.78)
  other vias: 46.99,44.45
N$145  (via drill 1.02 pad 1.78)
  other vias: 49.53,44.45
N$146  (via drill 1.02 pad 1.78)
  other vias: 52.07,44.45
N$147  (via drill 1.02 pad 1.78)
  other vias: 59.69,46.99
N$148  (via drill 1.02 pad 1.78)
  other vias: 57.15,31.75
N$149  (via drill 1.02 pad 1.78)
  other vias: 57.15,29.21
N$150  (via drill 1.02 pad 1.78)
  other vias: 64.77,24.13
N$151  (via drill 1.02 pad 1.78)
  other vias: 62.23,46.99
N$152  (via drill 1.02 pad 1.78)
  other vias: 64.77,46.99
N$153  (via drill 1.02 pad 1.78)
  other vias: 67.31,46.99
N$154  (via drill 1.02 pad 1.78)
  other vias: 72.39,46.99
N$155  (via drill 1.02 pad 1.78)
  other vias: 67.31,44.45
N$156  (via drill 1.02 pad 1.78)
  other vias: 64.77,44.45
N$157  (via drill 1.02 pad 1.78)
  other vias: 62.23,44.45
N$158  (via drill 1.02 pad 1.78)
  other vias: 57.15,44.45
N$159  (via drill 1.02 pad 1.78)
  other vias: 54.61,41.91
N$160  (via drill 1.02 pad 1.78)
  other vias: 52.07,41.91
N$161  (via drill 1.02 pad 1.78)
  other vias: 46.99,41.91
N$162  (via drill 1.02 pad 1.78)
  other vias: 59.69,31.75
N$163  (via drill 1.02 pad 1.78)
  other vias: 59.69,29.21
N$164  (via drill 1.02 pad 1.78)
  other vias: 57.15,41.91
N$165  (via drill 1.02 pad 1.78)
  other vias: 59.69,41.91
N$166  (via drill 1.02 pad 1.78)
  other vias: 62.23,41.91
N$167  (via drill 1.02 pad 1.78)
  other vias: 64.77,41.91
N$168  (via drill 1.02 pad 1.78)
  other vias: 67.31,41.91
N$169  (via drill 1.02 pad 1.78)
  other vias: 69.85,39.37
N$170  (via drill 1.02 pad 1.78)
  other vias: 67.31,39.37
N$171  (via drill 1.02 pad 1.78)
  other vias: 64.77,39.37
N$172  (via drill 1.02 pad 1.78)
  other vias: 62.23,31.75
N$173  (via drill 1.02 pad 1.78)
  other vias: 62.23,29.21
N$174  (via drill 1.02 pad 1.78)
  other vias: 62.23,39.37
N$175  (via drill 1.02 pad 1.78)
  other vias: 57.15,39.37
N$176  (via drill 1.02 pad 1.78)
  other vias: 54.61,39.37
N$177  (via drill 1.02 pad 1.78)
  other vias: 52.07,39.37
N$178  (via drill 1.02 pad 1.78)
  other vias: 46.99,39.37
N$179  (via drill 1.02 pad 1.78)
  other vias: 46.99,36.83
N$180  (via drill 1.02 pad 1.78)
  other vias: 46.99,34.29
N$181  (via drill 1.02 pad 1.78)
  other vias: 49.53,34.29
N$182  (via drill 1.02 pad 1.78)
  other vias: 52.07,34.29
N$183  (via drill 1.02 pad 1.78)
  other vias: 54.61,36.83
N$184  (via drill 1.02 pad 1.78)
  other vias: 49.53,36.83
N$185  (via drill 1.02 pad 1.78)
  other vias: 57.15,36.83
N$186  (via drill 1.02 pad 1.78)
  other vias: 64.77,31.75
N$187  (via drill 1.02 pad 1.78)
  other vias: 64.77,29.21
N$188  (via drill 1.02 pad 1.78)
  other vias: 59.69,36.83
N$189  (via drill 1.02 pad 1.78)
  other vias: 62.23,36.83
N$190  (via drill 1.02 pad 1.78)
  other vias: 64.77,36.83
N$191  (via drill 1.02 pad 1.78)
  other vias: 67.31,36.83
N$192  (via drill 1.02 pad 1.78)
  other vias: 69.85,34.29
N$193  (via drill 1.02 pad 1.78)
  other vias: 67.31,34.29
N$194  (via drill 1.02 pad 1.78)
  other vias: 64.77,34.29
N$195  (via drill 1.02 pad 1.78)
  other vias: 62.23,34.29
N$196  (via drill 1.02 pad 1.78)
  other vias: 67.31,31.75
N$197  (via drill 1.02 pad 1.78)
  other vias: 67.31,29.21
N$198  (via drill 1.02 pad 1.78)
  other vias: 57.15,34.29
N$199  (via drill 1.02 pad 1.78)
  other vias: 62.23,24.13
N$200  (via drill 1.02 pad 1.78)
  other vias: 59.69,24.13
N$201  (via drill 1.02 pad 1.78)
  other vias: 57.15,24.13
N$202  (via drill 1.02 pad 1.78)
  other vias: 54.61,21.59
N$203  (via drill 1.02 pad 1.78)
  other vias: 52.07,21.59
N$204  (via drill 1.02 pad 1.78)
  other vias: 49.53,21.59
N$205  (via drill 1.02 pad 1.78)
  other vias: 46.99,21.59
N$206  (via drill 1.02 pad 1.78)
  other vias: 57.15,21.59
N$207  (via drill 1.02 pad 1.78)
  other vias: 59.69,21.59
N$208  (via drill 1.02 pad 1.78)
  other vias: 62.23,21.59
N$209  (via drill 1.02 pad 1.78)
  other vias: 64.77,21.59
N$210  (via drill 1.02 pad 1.78)
  other vias: 69.85,31.75
N$211  (via drill 1.02 pad 1.78)
  other vias: 69.85,21.59
N$212  (via drill 1.02 pad 1.78)
  other vias: 67.31,21.59
N$213  (via drill 1.02 pad 1.78)
  other vias: 69.85,19.05
N$214  (via drill 1.02 pad 1.78)
  other vias: 67.31,19.05
N$215  (via drill 1.02 pad 1.78)
  other vias: 64.77,19.05
N$216  (via drill 1.02 pad 1.78)
  other vias: 62.23,19.05
N$217  (via drill 1.02 pad 1.78)
  other vias: 59.69,19.05
N$218  (via drill 1.02 pad 1.78)
  other vias: 57.15,19.05
N$219  (via drill 1.02 pad 1.78)
  other vias: 54.61,19.05
N$220  (via drill 1.02 pad 1.78)
  other vias: 52.07,19.05
N$221  (via drill 1.02 pad 1.78)
  other vias: 49.53,19.05
N$222  (via drill 1.02 pad 1.78)
  other vias: 46.99,19.05
N$223  (via drill 1.02 pad 1.78)
  other vias: 46.99,16.51
N$224  (via drill 1.02 pad 1.78)
  other vias: 46.99,13.97
N$225  (via drill 1.02 pad 1.78)
  other vias: 49.53,13.97
N$226  (via drill 1.02 pad 1.78)
  other vias: 54.61,13.97
N$227  (via drill 1.02 pad 1.78)
  other vias: 52.07,13.97
N$228  (via drill 1.02 pad 1.78)
  other vias: 54.61,16.51
N$229  (via drill 1.02 pad 1.78)
  other vias: 52.07,16.51
N$230  (via drill 1.02 pad 1.78)
  other vias: 49.53,16.51
N$231  (via drill 1.02 pad 1.78)
  other vias: 57.15,16.51
N$232  (via drill 1.02 pad 1.78)
  other vias: 59.69,16.51
N$233  (via drill 1.02 pad 1.78)
  other vias: 62.23,16.51
N$234  (via drill 1.02 pad 1.78)
  other vias: 64.77,16.51
N$235  (via drill 1.02 pad 1.78)
  other vias: 69.85,16.51
N$236  (via drill 1.02 pad 1.78)
  other vias: 67.31,16.51
N$237  (via drill 1.02 pad 1.78)
  other vias: 69.85,13.97
N$238  (via drill 1.02 pad 1.78)
  other vias: 67.31,13.97
N$239  (via drill 1.02 pad 1.78)
  other vias: 64.77,13.97
N$240  (via drill 1.02 pad 1.78)
  other vias: 62.23,13.97
N$241  (via drill 1.02 pad 1.78)
  other vias: 59.69,13.97
N$242  (via drill 1.02 pad 1.78)
  other vias: 57.15,13.97
N$243  (via drill 1.02 pad 1.78)
  other vias: 69.85,29.21
N$244  (via drill 1.02 pad 1.78)
  other vias: 46.99,26.67
N$245  (via drill 1.02 pad 1.78)
  other vias: 44.45,26.67
N$246  (via drill 1.02 pad 1.78)
  other vias: 49.53,26.67
N$247  (via drill 1.02 pad 1.78)
  other vias: 52.07,26.67
N$248  (via drill 1.02 pad 1.78)
  other vias: 44.45,46.99
N$249  (via drill 1.02 pad 1.78)
  other vias: 46.99,46.99
N$250  (via drill 1.02 pad 1.78)
  other vias: 49.53,46.99
N$251  (via drill 1.02 pad 1.78)
  other vias: 52.07,46.99
N$252  (via drill 1.02 pad 1.78)
  other vias: 72.39,31.75
N$253  (via drill 1.02 pad 1.78)
  other vias: 72.39,29.21
N$254
  Top 0.406: LED1.K T1.C 95.25,83.82 96.52,82.55 D1.A 104.14,82.55 105.41,81.28 105.41,77.47 106.68,76.2 106.68,65.53 K1.5
N$255  (via drill 1.02 pad 1.78)
  other vias: 74.93,41.91
N$256  (via drill 1.02 pad 1.78)
  other vias: 72.39,41.91
N$257  (via drill 1.02 pad 1.78)
  other vias: 74.93,39.37
N$258  (via drill 1.02 pad 1.78)
  other vias: 72.39,39.37
N$259  (via drill 1.02 pad 1.78)
  other vias: 74.93,36.83
N$260  (via drill 1.02 pad 1.78)
  other vias: 72.39,36.83
N$261  (via drill 1.02 pad 1.78)
  other vias: 74.93,34.29
N$262  (via drill 1.02 pad 1.78)
  other vias: 72.39,34.29
N$263  (via drill 1.02 pad 1.78)
  other vias: 74.93,26.67
N$264  (via drill 1.02 pad 1.78)
  other vias: 72.39,26.67
N$265  (via drill 1.02 pad 1.78)
  other vias: 74.93,24.13
N$266  (via drill 1.02 pad 1.78)
  other vias: 72.39,24.13
N$267  (via drill 1.02 pad 1.78)
  other vias: 74.93,21.59
N$268  (via drill 1.02 pad 1.78)
  other vias: 72.39,21.59
N$269  (via drill 1.02 pad 1.78)
  other vias: 74.93,19.05
N$270  (via drill 1.02 pad 1.78)
  other vias: 72.39,16.51
N$271
  Bottom 1.27: K1.4 101.37,62.36 105.94,57.79 CON1.1
N$272  (via drill 1.02 pad 1.78)
  Top 1.27: v26.67,29.21 v74.93,29.21
  Bottom 1.27: v26.67,29.21 v74.93,29.21
N$273  (via drill 1.02 pad 1.78)
  other vias: 72.39,19.05
N$274  (via drill 1.02 pad 1.78)
  other vias: 72.39,13.97
N$275  (via drill 1.02 pad 1.78)
  other vias: 69.85,44.45
N$276  (via drill 1.02 pad 1.78)
  other vias: 72.39,44.45
N$278  (1 unrouted)
  Top 0.406: U$6.VBUS 103.2,92 103.76,91.44 106.68,91.44 107.95,90.17 SV3.1 109.22,88.9 110.49,87.63 110.49,83.82 109.22,82.55 D1.C R4.1 107.95,72.39 109.86,70.48 K1.1 | U$6.VBUS
N$279
  Top 0.406: T1.B 95.25,86.36 96.52,85.09 R3.1
N$280
  Bottom 0.406: U$6.D- 102.4,96.66 102.9,97.15 107.31,97.15 107.95,96.52 107.95,92.71 105.41,90.17 SV3.2 105.41,86.36 106.68,85.09 R3.2
N$281
  Top 0.406: R4.2 96.52,78.74 LED1.A
N$282
  Top 1.27: CON1.2 100.94,68.73 K1.2
N$283
  Top 1.27: CON1.3 90.17,60.63 90.17,68.07 K1.3
N$284  (2 unrouted)
  Top 0.406: U$6.D+ 101.6,91.44 102.87,90.17 SV3.3
N$285
  Bottom 0.406: SV3.4 100.33,90.17 99.06,91.44 96.52,91.44 95.25,92.71 95.25,96.52 95.89,97.15 100.28,97.15 100.8,96.63 U$6.ID
N$287
  Top 0.406: U$7.VBUS 95.58,32.08 96.52,33.02 96.52,34.29 97.79,35.56 SV4.1
N$288
  Bottom 0.406: U$7.D- 91.38,31.28 90.86,31.8 90.86,36.25 91.44,36.83 95.25,36.83 96.52,35.56 96.52,34.29 97.79,33.02 SV4.2
N$289
  Top 0.406: U$7.D+ SV4.3
N$290
  Bottom 0.406: U$7.ID 91.45,29.68 90.86,29.08 90.86,24.71 91.44,24.13 95.25,24.13 96.52,25.4 96.52,26.67 97.79,27.94 SV4.4
N$292
  Top 0.406: R5.2 12.7,86.36 | 12.7,86.36 13.97,85.09 16.51,85.09 17.78,83.82 17.78,81.61 16.51,80.34 U$8.VBUS | 12.7,86.36 13.97,87.63 13.97,90.17 16.51,92.71 16.51,97.79 17.78,99.06 81.28,99.06 82.55,97.79 82.55,88.9 80.01,86.36 SV6.1
  Bottom 0.406: U$8.VBUS 19.38,80.34 20.32,81.28 20.32,82.55 21.59,83.82 SV5.1
N$293  (via drill 0.6)
  Top 0.406: SV5.2 21.59,81.28 20.32,82.55 20.32,85.09 21.59,86.36 v21.59,91.44
  Bottom 0.406: U$8.D- 12.76,79.54 12.04,80.26 12.04,89.51 12.7,90.17 20.32,90.17 v21.59,91.44 21.59,97.79 22.86,99.06 81.28,99.06 82.55,97.79 82.55,88.9 81.28,87.63 78.74,87.63 77.47,86.36 77.47,82.55 78.74,81.28 SV6.2
N$294
  Top 0.406: 17.78,78.74 U$8.D+ | 17.78,78.74 SV5.3 | R6.2 19.05,77.47 17.78,78.74 | 17.78,78.74 19.05,80.01 R5.1 19.05,96.52 20.32,97.79 73.66,97.79 74.93,96.52 74.93,93.98 77.47,91.44 77.47,80.01 78.74,78.74 SV6.3
N$295
  Bottom 0.406: U$8.ID 12.66,77.94 12.07,77.34 12.07,73.02 12.7,72.39 16.51,72.39 | 16.51,72.39 17.78,73.66 17.78,74.93 19.05,76.2 SV5.4 | 16.51,72.39 16.51,59.69 17.78,58.42 81.28,58.42 82.55,59.69 82.55,68.58 81.28,69.85 78.74,69.85 77.47,71.12 77.47,74.93 78.74,76.2 SV6.4
N$296  (via drill 1.02 pad 1.78)
  other vias: 26.67,95.25
N$297  (via drill 1.02 pad 1.78)
  other vias: 29.21,95.25
N$298  (via drill 1.02 pad 1.78)
  other vias: 31.75,95.25
N$299  (via drill 1.02 pad 1.78)
  other vias: 34.29,95.25
N$300  (via drill 1.02 pad 1.78)
  other vias: 36.83,95.25
N$301  (via drill 1.02 pad 1.78)
  other vias: 39.37,95.25
N$302  (via drill 1.02 pad 1.78)
  other vias: 41.91,95.25
N$303  (via drill 1.02 pad 1.78)
  other vias: 26.67,92.71
N$304  (via drill 1.02 pad 1.78)
  other vias: 29.21,92.71
N$305  (via drill 1.02 pad 1.78)
  other vias: 31.75,92.71
N$306  (via drill 1.02 pad 1.78)
  other vias: 34.29,92.71
N$307  (via drill 1.02 pad 1.78)
  other vias: 36.83,92.71
N$308  (via drill 1.02 pad 1.78)
  other vias: 39.37,92.71
N$309  (via drill 1.02 pad 1.78)
  other vias: 41.91,92.71
N$310  (via drill 1.02 pad 1.78)
  other vias: 44.45,92.71
N$311  (via drill 1.02 pad 1.78)
  other vias: 26.67,90.17
N$312  (via drill 1.02 pad 1.78)
  other vias: 29.21,90.17
N$313  (via drill 1.02 pad 1.78)
  other vias: 31.75,90.17
N$314  (via drill 1.02 pad 1.78)
  other vias: 34.29,90.17
N$315  (via drill 1.02 pad 1.78)
  other vias: 36.83,90.17
N$316  (via drill 1.02 pad 1.78)
  other vias: 39.37,90.17
N$317  (via drill 1.02 pad 1.78)
  other vias: 41.91,90.17
N$318  (via drill 1.02 pad 1.78)
  other vias: 44.45,90.17
N$319
  Top 0.305: 37.46,84.35 37.46,86.97 36.83,87.6
N$320  (via drill 1.02 pad 1.78)
  other vias: 52.07,85.09
N$321  (via drill 1.02 pad 1.78)
  other vias: 52.07,82.55
N$323  (via drill 1.02 pad 1.78)
  other vias: 36.83,87.63
N$324  (via drill 1.02 pad 1.78)
  other vias: 39.37,87.63
N$326  (via drill 1.02 pad 1.78)
  Top 0.305: 34.9,84.33 34.9,85.24 34.29,85.85 32.26,85.85 31.75,86.36 v31.75,87.63
N$327  (via drill 1.02 pad 1.78)
  other vias: 57.15,95.25
N$328  (via drill 1.02 pad 1.78)
  other vias: 46.99,92.71
N$329  (via drill 1.02 pad 1.78)
  other vias: 49.53,92.71
N$330  (via drill 1.02 pad 1.78)
  other vias: 54.61,92.71
N$331  (via drill 1.02 pad 1.78)
  other vias: 52.07,92.71
N$332  (via drill 1.02 pad 1.78)
  other vias: 59.69,95.25
N$333  (via drill 1.02 pad 1.78)
  other vias: 62.23,95.25
N$334  (via drill 1.02 pad 1.78)
  other vias: 64.77,95.25
N$335  (via drill 1.02 pad 1.78)
  other vias: 69.85,95.25
N$336  (via drill 1.02 pad 1.78)
  other vias: 67.31,95.25
N$337  (via drill 1.02 pad 1.78)
  other vias: 67.31,92.71
N$338  (via drill 1.02 pad 1.78)
  other vias: 64.77,92.71
N$339  (via drill 1.02 pad 1.78)
  other vias: 62.23,92.71
N$340  (via drill 1.02 pad 1.78)
  other vias: 59.69,92.71
N$341  (via drill 1.02 pad 1.78)
  other vias: 57.15,92.71
N$342  (via drill 1.02 pad 1.78)
  other vias: 54.61,90.17
N$343  (via drill 1.02 pad 1.78)
  other vias: 52.07,90.17
N$344  (via drill 1.02 pad 1.78)
  other vias: 49.53,90.17
N$345  (via drill 1.02 pad 1.78)
  other vias: 46.99,90.17
N$346  (via drill 1.02 pad 1.78)
  other vias: 57.15,90.17
N$347  (via drill 1.02 pad 1.78)
  other vias: 59.69,90.17
N$348  (via drill 1.02 pad 1.78)
  other vias: 62.23,90.17
N$349  (via drill 1.02 pad 1.78)
  other vias: 64.77,90.17
N$350  (via drill 1.02 pad 1.78)
  other vias: 69.85,90.17
N$351  (via drill 1.02 pad 1.78)
  other vias: 67.31,90.17
N$352  (via drill 1.02 pad 1.78)
  other vias: 52.07,80.01
N$353  (via drill 1.02 pad 1.78)
  other vias: 52.07,77.47
N$356  (via drill 1.02 pad 1.78)
  other vias: 52.07,74.93
N$357  (via drill 1.02 pad 1.78)
  other vias: 52.07,72.39
N$359  (via drill 1.02 pad 1.78)
  other vias: 52.07,87.63
N$360  (via drill 1.02 pad 1.78)
  Top 0.305: 33.63,84.28 33.63,84.48 33.02,85.09 30.48,85.09 29.21,86.36 v29.21,87.63
N$361  (via drill 1.02 pad 1.78)
  Top 0.305: 34.9,73.3 34.9,72.24 34.29,71.63 32.26,71.63 31.75,71.12 v31.75,69.85
N$362  (via drill 1.02 pad 1.78)
  other vias: 44.45,95.25
N$363  (via drill 1.02 pad 1.78)
  other vias: 46.99,95.25
N$364  (via drill 1.02 pad 1.78)
  other vias: 49.53,95.25
N$365  (via drill 1.02 pad 1.78)
  other vias: 54.61,95.25
N$366  (via drill 1.02 pad 1.78)
  other vias: 52.07,95.25
N$367  (via drill 1.02 pad 1.78)
  other vias: 72.39,90.17
N$369  (via drill 1.02 pad 1.78)
  other vias: 69.85,92.71
N$370  (via drill 1.02 pad 1.78)
  other vias: 72.39,95.25
N$371  (via drill 1.02 pad 1.78)
  other vias: 72.39,92.71
N$372
  Top 0.305: 38.71,84.35 38.71,86.99 39.37,87.65
N$373  (via drill 1.02 pad 1.78)
  other vias: 49.53,74.93
N$374  (via drill 1.02 pad 1.78)
  other vias: 49.53,77.47
N$375  (via drill 1.02 pad 1.78)
  Top 0.305: 36.17,73.18 36.17,71.73 v34.29,69.85
N$376  (via drill 1.02 pad 1.78)
  other vias: 36.83,69.85
N$377  (via drill 1.02 pad 1.78)
  other vias: 39.37,69.85
N$378  (via drill 1.02 pad 1.78)
  Top 0.305: 39.98,73.13 39.98,71.78 v41.91,69.85
N$379  (via drill 1.02 pad 1.78)
  other vias: 26.67,67.31
N$380  (via drill 1.02 pad 1.78)
  other vias: 29.21,67.31
N$381  (via drill 1.02 pad 1.78)
  other vias: 31.75,67.31
N$382  (via drill 1.02 pad 1.78)
  other vias: 34.29,67.31
N$383  (via drill 1.02 pad 1.78)
  other vias: 36.83,67.31
N$384  (via drill 1.02 pad 1.78)
  other vias: 39.37,67.31
N$385  (via drill 1.02 pad 1.78)
  other vias: 41.91,67.31
N$386  (via drill 1.02 pad 1.78)
  other vias: 44.45,67.31
N$387  (via drill 1.02 pad 1.78)
  other vias: 26.67,64.77
N$388  (via drill 1.02 pad 1.78)
  other vias: 29.21,64.77
N$389  (via drill 1.02 pad 1.78)
  other vias: 31.75,64.77
N$390  (via drill 1.02 pad 1.78)
  other vias: 34.29,64.77
N$391  (via drill 1.02 pad 1.78)
  other vias: 36.83,64.77
N$392  (via drill 1.02 pad 1.78)
  other vias: 39.37,64.77
N$393  (via drill 1.02 pad 1.78)
  other vias: 41.91,64.77
N$394  (via drill 1.02 pad 1.78)
  other vias: 44.45,64.77
N$395  (via drill 1.02 pad 1.78)
  other vias: 26.67,62.23
N$396  (via drill 1.02 pad 1.78)
  other vias: 29.21,62.23
N$397  (via drill 1.02 pad 1.78)
  other vias: 31.75,62.23
N$398  (via drill 1.02 pad 1.78)
  other vias: 34.29,62.23
N$399  (via drill 1.02 pad 1.78)
  other vias: 36.83,62.23
N$400  (via drill 1.02 pad 1.78)
  other vias: 39.37,62.23
N$401  (via drill 1.02 pad 1.78)
  other vias: 41.91,62.23
N$402  (via drill 1.02 pad 1.78)
  other vias: 44.45,62.23
N$403  (via drill 1.02 pad 1.78)
  other vias: 49.53,80.01
N$404  (via drill 1.02 pad 1.78)
  other vias: 46.99,67.31
N$405  (via drill 1.02 pad 1.78)
  other vias: 49.53,67.31
N$406  (via drill 1.02 pad 1.78)
  other vias: 54.61,67.31
N$407  (via drill 1.02 pad 1.78)
  other vias: 52.07,67.31
N$408  (via drill 1.02 pad 1.78)
  other vias: 49.53,82.55
N$411  (via drill 1.02 pad 1.78)
  other vias: 46.99,82.55
N$412  (via drill 1.02 pad 1.78)
  other vias: 46.99,80.01
N$413  (via drill 1.02 pad 1.78)
  other vias: 67.31,67.31
N$414  (via drill 1.02 pad 1.78)
  other vias: 64.77,67.31
N$415  (via drill 1.02 pad 1.78)
  other vias: 62.23,67.31
N$416  (via drill 1.02 pad 1.78)
  other vias: 59.69,67.31
N$417  (via drill 1.02 pad 1.78)
  other vias: 57.15,67.31
N$418  (via drill 1.02 pad 1.78)
  other vias: 54.61,64.77
N$419  (via drill 1.02 pad 1.78)
  other vias: 52.07,64.77
N$420  (via drill 1.02 pad 1.78)
  other vias: 49.53,64.77
N$421  (via drill 1.02 pad 1.78)
  other vias: 46.99,64.77
N$422  (via drill 1.02 pad 1.78)
  other vias: 57.15,64.77
N$423  (via drill 1.02 pad 1.78)
  other vias: 59.69,64.77
N$424  (via drill 1.02 pad 1.78)
  other vias: 62.23,64.77
N$425  (via drill 1.02 pad 1.78)
  other vias: 64.77,64.77
N$426  (via drill 1.02 pad 1.78)
  other vias: 69.85,64.77
N$427  (via drill 1.02 pad 1.78)
  other vias: 67.31,64.77
N$428  (via drill 1.02 pad 1.78)
  other vias: 69.85,62.23
N$429  (via drill 1.02 pad 1.78)
  other vias: 67.31,62.23
N$430  (via drill 1.02 pad 1.78)
  other vias: 64.77,62.23
N$431  (via drill 1.02 pad 1.78)
  other vias: 62.23,62.23
N$432  (via drill 1.02 pad 1.78)
  other vias: 59.69,62.23
N$433  (via drill 1.02 pad 1.78)
  other vias: 57.15,62.23
N$434  (via drill 1.02 pad 1.78)
  other vias: 54.61,62.23
N$435  (via drill 1.02 pad 1.78)
  other vias: 52.07,62.23
N$436  (via drill 1.02 pad 1.78)
  other vias: 49.53,62.23
N$437  (via drill 1.02 pad 1.78)
  other vias: 46.99,62.23
N$438  (via drill 1.02 pad 1.78)
  Top 0.305: 33.63,73.25 33.63,73 33.02,72.39 30.48,72.39 29.21,71.12 v29.21,69.85
N$442  (via drill 1.02 pad 1.78)
  other vias: 52.07,69.85
N$443  (via drill 1.02 pad 1.78)
  other vias: 72.39,64.77
N$444  (via drill 1.02 pad 1.78)
  other vias: 72.39,62.23
N$445  (via drill 1.02 pad 1.78)
  other vias: 69.85,67.31
N$447  (via drill 1.02 pad 1.78)
  other vias: 72.39,67.31
N$448
  Top 0.305: 37.44,73.13 37.44,70.38 36.88,69.82
N$450
  Top 0.305: 38.71,73.15 38.71,70.48 39.37,69.82
N$451  (via drill 1.02 pad 1.78)
  Top 0.305: 39.98,84.15 39.98,85.7 v41.91,87.63
N$452  (via drill 1.02 pad 1.78)
  Top 0.305: 36.17,84.2 36.17,85.75 v34.29,87.63
N$453  (via drill 1.02 pad 1.78)
  Top 0.305: 41.25,84.33 41.25,85.19 41.91,85.85 43.94,85.85 44.45,86.36 v44.45,87.63
N$455  (via drill 1.02 pad 1.78)
  Top 0.305: 42.54,84.28 42.54,84.45 43.18,85.09 45.72,85.09 46.99,86.36 v46.99,87.63
N$457  (via drill 1.02 pad 1.78)
  Top 0.305: 41.25,73.25 41.25,72.24 41.86,71.63 43.94,71.63 44.45,71.12 v44.45,69.85
N$458  (via drill 1.02 pad 1.78)
  Top 0.305: 42.54,73.28 42.54,73.02 43.18,72.39 45.72,72.39 46.99,71.12 v46.99,69.85
N$459  (via drill 1.02 pad 1.78)
  Top 0.305: v49.53,69.85 45.72,73.66 43.94,73.66 43.92,73.68
N$462  (via drill 1.02 pad 1.78)
  Top 0.305: 57.76,82.27 57.76,87.02 v57.15,87.63
N$463  (via drill 1.02 pad 1.78)
  Top 0.305: 57.78,75.34 57.78,70.48 v57.15,69.85
N$465  (via drill 1.02 pad 1.78)
  other vias: 46.99,77.47
N$466  (via drill 1.02 pad 1.78)
  other vias: 46.99,74.93
N$467  (via drill 1.02 pad 1.78)
  other vias: 54.61,77.47
N$468  (via drill 1.02 pad 1.78)
  other vias: 54.61,80.01
N$469  (via drill 1.02 pad 1.78)
  other vias: 62.23,77.47
N$470  (via drill 1.02 pad 1.78)
  other vias: 64.77,77.47
N$471  (via drill 1.02 pad 1.78)
  other vias: 64.77,80.01
N$472  (via drill 1.02 pad 1.78)
  other vias: 62.23,80.01
N$473  (via drill 1.02 pad 1.78)
  other vias: 74.93,87.63
N$474  (via drill 1.02 pad 1.78)
  other vias: 74.93,90.17
N$475  (via drill 1.02 pad 1.78)
  other vias: 74.93,85.09
N$476  (via drill 1.02 pad 1.78)
  other vias: 74.93,82.55
N$477  (via drill 1.02 pad 1.78)
  other vias: 74.93,80.01
N$478  (via drill 1.02 pad 1.78)
  other vias: 74.93,77.47
N$479  (via drill 1.02 pad 1.78)
  other vias: 74.93,74.93
N$480  (via drill 1.02 pad 1.78)
  other vias: 74.93,72.39
N$481  (via drill 1.02 pad 1.78)
  other vias: 74.93,69.85
N$482  (via drill 1.02 pad 1.78)
  other vias: 74.93,67.31
N$484  (via drill 1.02 pad 1.78)
  other vias: 72.39,80.01
N$485  (via drill 1.02 pad 1.78)
  other vias: 72.39,77.47
N$486  (via drill 1.02 pad 1.78)
  other vias: 26.67,74.93
N$487  (via drill 1.02 pad 1.78)
  other vias: 26.67,77.47
N$488  (via drill 1.02 pad 1.78)
  other vias: 26.67,80.01
N$489  (via drill 1.02 pad 1.78)
  other vias: 26.67,82.55
N$490  (via drill 1.02 pad 1.78)
  other vias: 29.21,82.55
N$491  (via drill 1.02 pad 1.78)
  other vias: 29.21,80.01
N$492  (via drill 1.02 pad 1.78)
  other vias: 29.21,77.47
N$493  (via drill 1.02 pad 1.78)
  other vias: 29.21,74.93
N$494  (via drill 1.02 pad 1.78)
  other vias: 49.53,72.39
N$495  (via drill 1.02 pad 1.78)
  Top 0.305: 56.52,75.13 56.52,71.75 v54.61,69.85
N$496  (via drill 1.02 pad 1.78)
  other vias: 54.61,74.93
N$497  (via drill 1.02 pad 1.78)
  other vias: 54.61,72.39
N$498  (via drill 1.02 pad 1.78)
  Top 0.305: 56.49,82.24 56.49,85.75 v54.61,87.63
N$499  (via drill 1.02 pad 1.78)
  other vias: 54.61,85.09
N$500  (via drill 1.02 pad 1.78)
  other vias: 54.61,82.55
N$501  (via drill 1.02 pad 1.78)
  Top 0.305: v49.53,87.63 45.72,83.82 43.89,83.82 43.87,83.84
N$502  (via drill 1.02 pad 1.78)
  other vias: 49.53,85.09
N$503  (via drill 1.02 pad 1.78)
  Top 0.305: v26.67,87.63 30.48,83.82 32.33,83.82 32.36,83.84
N$504  (via drill 1.02 pad 1.78)
  other vias: 26.67,85.09
N$505  (via drill 1.02 pad 1.78)
  Top 0.305: v26.67,69.85 30.48,73.66 32.28,73.66 32.33,73.71
N$506  (via drill 1.02 pad 1.78)
  other vias: 26.67,72.39
N$507  (via drill 1.02 pad 1.78)
  Top 0.305: 60.3,82.27 60.3,85.7 v62.23,87.63
N$508  (via drill 1.02 pad 1.78)
  other vias: 62.23,85.09
N$509  (via drill 1.02 pad 1.78)
  other vias: 62.23,82.55
N$510  (via drill 1.02 pad 1.78)
  Top 0.305: 59.05,82.19 59.05,86.99 v59.69,87.63
N$511  (via drill 1.02 pad 1.78)
  Top 0.305: 59.05,75.29 59.05,70.48 v59.69,69.85
N$512  (via drill 1.02 pad 1.78)
  Top 0.305: 60.35,75.31 60.35,71.73 v62.23,69.85
N$513  (via drill 1.02 pad 1.78)
  other vias: 62.23,72.39
N$514  (via drill 1.02 pad 1.78)
  other vias: 62.23,74.93
N$515  (via drill 1.02 pad 1.78)
  Top 0.305: 66.65,82.19 66.65,85.75 v64.77,87.63
N$516  (via drill 1.02 pad 1.78)
  other vias: 64.77,85.09
N$517  (via drill 1.02 pad 1.78)
  other vias: 64.77,82.55
N$518  (via drill 1.02 pad 1.78)
  other vias: 64.77,74.93
N$519  (via drill 1.02 pad 1.78)
  other vias: 64.77,72.39
N$520  (via drill 1.02 pad 1.78)
  Top 0.305: 66.67,75.29 66.67,71.75 v64.77,69.85
N$521  (via drill 1.02 pad 1.78)
  Top 0.305: 67.95,75.26 67.95,70.48 v67.31,69.85
N$522  (via drill 1.02 pad 1.78)
  Top 0.305: 67.92,82.12 67.92,87.02 v67.31,87.63
N$523  (via drill 1.02 pad 1.78)
  other vias: 72.39,82.55
N$524  (via drill 1.02 pad 1.78)
  other vias: 72.39,85.09
N$525  (via drill 1.02 pad 1.78)
  Top 0.305: 70.48,82.22 70.48,85.72 v72.39,87.63
N$526  (via drill 1.02 pad 1.78)
  other vias: 72.39,74.93
N$527  (via drill 1.02 pad 1.78)
  other vias: 72.39,72.39
N$528  (via drill 1.02 pad 1.78)
  Top 0.305: 70.51,75.34 70.51,71.73 v72.39,69.85
N$529  (via drill 1.02 pad 1.78)
  Top 0.305: 69.22,75.39 69.22,70.48 v69.85,69.85
N$530  (via drill 1.02 pad 1.78)
  Top 0.305: 69.19,82.17 69.19,86.97 v69.85,87.63
VBUS
  Top 0.406: 12.7,38.1 R1.2 | 12.7,38.1 13.97,39.37 13.97,41.91 16.51,44.45 16.51,49.53 17.78,50.8 81.28,50.8 82.55,49.53 82.55,40.64 80.01,38.1 SV1.1 | 12.7,38.1 13.97,36.83 16.51,36.83 17.78,35.56 17.78,33.02 16.84,32.09 U$1.VBUS
  Bottom 0.406: U$1.VBUS 19.39,32.09 20.32,33.02 20.32,34.29 21.59,35.56 SV2.1

### Text on the board
tPlace: GND | 5V | 5V | 5V | Ninja Relay Board | IO1 | IO1 | IO2 | IO2 | SOIC8 | SOIC8 | IO3 | IO3 | GND | GND | Ninja SMD Breakout Board | NO | COM | NC | 5V | 5V | 5V | Ninja Mini Breakout | IO1 | IO1 | IO1 | IO2 | IO2 | IO2 | IO3 | IO3 | IO3 | GND | GND | GND | Ninja PTH Breakout Board | CC